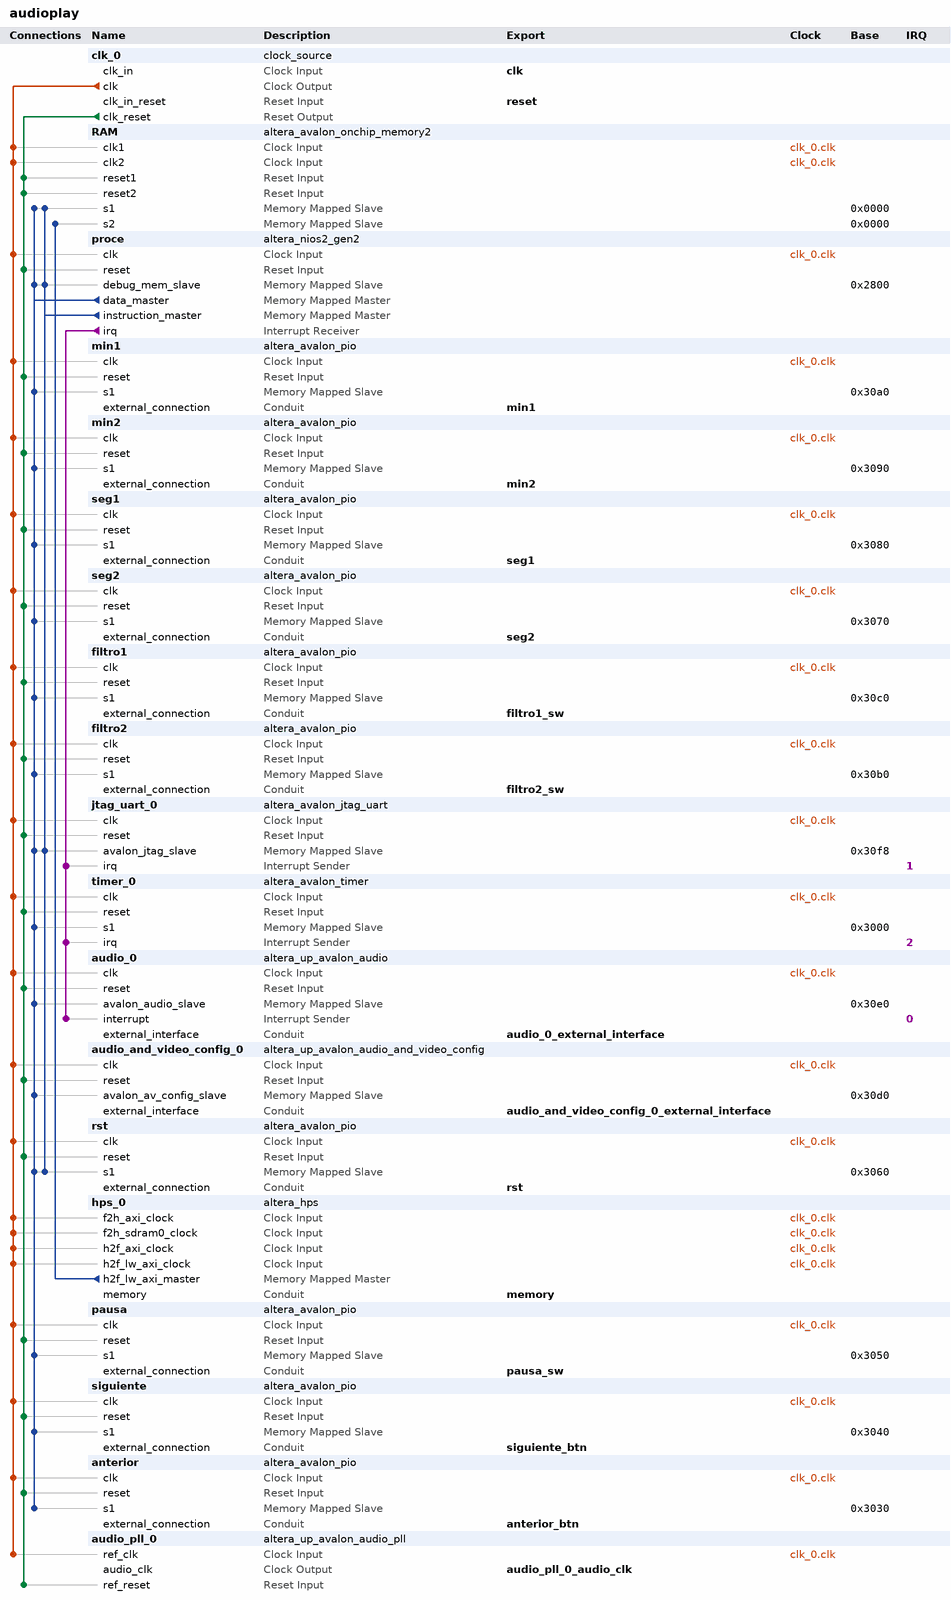
[diagram p0: system contents]
# Platform Designer (Qsys) system audioplay, Cyclone V 5CSEMA5F31C6
# Parameters at their usual value, and those the tool derives, are not listed.
package require -exact qsys 18.0
create_system audioplay
set_project_property DEVICE_FAMILY {Cyclone V}
set_project_property DEVICE 5CSEMA5F31C6

add_instance clk_0 clock_source 18.0
set_instance_parameter_value clk_0 clockFrequency 50000000

add_instance RAM altera_avalon_onchip_memory2 18.0
set_instance_parameter_value RAM dataWidth 32
set_instance_parameter_value RAM dualPort true
set_instance_parameter_value RAM initMemContent true
set_instance_parameter_value RAM initializationFileName onchip_mem.hex
set_instance_parameter_value RAM memorySize 8192

add_instance proce altera_nios2_gen2 18.0
set_instance_parameter_value proce dcache_size 2048
set_instance_parameter_value proce exceptionSlave RAM.s1
set_instance_parameter_value proce icache_size 4096
set_instance_parameter_value proce impl Fast
set_instance_parameter_value proce resetSlave RAM.s1

add_instance min1 altera_avalon_pio 18.0
set_instance_parameter_value min1 direction Output
set_instance_parameter_value min1 width 7

add_instance min2 altera_avalon_pio 18.0
set_instance_parameter_value min2 direction Output
set_instance_parameter_value min2 width 7

add_instance seg1 altera_avalon_pio 18.0
set_instance_parameter_value seg1 direction Output
set_instance_parameter_value seg1 width 7

add_instance seg2 altera_avalon_pio 18.0
set_instance_parameter_value seg2 direction Output
set_instance_parameter_value seg2 width 7

add_instance filtro1 altera_avalon_pio 18.0
set_instance_parameter_value filtro1 direction Input
set_instance_parameter_value filtro1 width 1

add_instance filtro2 altera_avalon_pio 18.0
set_instance_parameter_value filtro2 direction Input
set_instance_parameter_value filtro2 width 1

add_instance jtag_uart_0 altera_avalon_jtag_uart 18.0
set_instance_parameter_value jtag_uart_0 simInteractiveOptions NO_INTERACTIVE_WINDOWS

add_instance timer_0 altera_avalon_timer 18.0
set_instance_parameter_value timer_0 period 1
set_instance_parameter_value timer_0 periodUnits MSEC

add_instance audio_0 altera_up_avalon_audio 18.0
set_instance_parameter_value audio_0 audio_in false
set_instance_parameter_value audio_0 avalon_bus_type {Memory Mapped}
set_instance_parameter_value audio_0 dw 24

add_instance audio_and_video_config_0 altera_up_avalon_audio_and_video_config 18.0
set_instance_parameter_value audio_and_video_config_0 audio_in {Microphone to ADC}
set_instance_parameter_value audio_and_video_config_0 bit_length 24
set_instance_parameter_value audio_and_video_config_0 board DE1-SoC
set_instance_parameter_value audio_and_video_config_0 line_in_bypass false
set_instance_parameter_value audio_and_video_config_0 sampling_rate {48 kHz}

add_instance rst altera_avalon_pio 18.0
set_instance_parameter_value rst direction Input
set_instance_parameter_value rst width 1

add_instance hps_0 altera_hps 18.0
set_instance_parameter_value hps_0 EMAC1_Mode N/A
set_instance_parameter_value hps_0 EMAC1_PinMuxing Unused
set_instance_parameter_value hps_0 F2SCLK_COLDRST_Enable false
set_instance_parameter_value hps_0 F2SCLK_DBGRST_Enable false
set_instance_parameter_value hps_0 F2SCLK_WARMRST_Enable false
set_instance_parameter_value hps_0 F2SDRAM_Type AXI-3
set_instance_parameter_value hps_0 F2SDRAM_Width 64
set_instance_parameter_value hps_0 F2SINTERRUPT_Enable false
set_instance_parameter_value hps_0 F2S_Width 2
set_instance_parameter_value hps_0 FPGA_PERIPHERAL_OUTPUT_CLOCK_FREQ_EMAC0_GTX_CLK 125
set_instance_parameter_value hps_0 FPGA_PERIPHERAL_OUTPUT_CLOCK_FREQ_EMAC0_MD_CLK 2.5
set_instance_parameter_value hps_0 FPGA_PERIPHERAL_OUTPUT_CLOCK_FREQ_EMAC1_GTX_CLK 125
set_instance_parameter_value hps_0 FPGA_PERIPHERAL_OUTPUT_CLOCK_FREQ_EMAC1_MD_CLK 2.5
set_instance_parameter_value hps_0 HPS_PROTOCOL DDR3
set_instance_parameter_value hps_0 I2C0_Mode N/A
set_instance_parameter_value hps_0 I2C0_PinMuxing Unused
set_instance_parameter_value hps_0 I2C1_Mode N/A
set_instance_parameter_value hps_0 I2C1_PinMuxing Unused
set_instance_parameter_value hps_0 LWH2F_Enable true
set_instance_parameter_value hps_0 MEM_BANKADDR_WIDTH 3
set_instance_parameter_value hps_0 MEM_CLK_FREQ 300.0
set_instance_parameter_value hps_0 MEM_CLK_FREQ_MAX 400.0
set_instance_parameter_value hps_0 MEM_COL_ADDR_WIDTH 8
set_instance_parameter_value hps_0 MEM_DQ_WIDTH 8
set_instance_parameter_value hps_0 MEM_DRV_STR RZQ/6
set_instance_parameter_value hps_0 MEM_ROW_ADDR_WIDTH 12
set_instance_parameter_value hps_0 MEM_RTT_NOM {ODT Disabled}
set_instance_parameter_value hps_0 MEM_RTT_WR {Dynamic ODT off}
set_instance_parameter_value hps_0 MEM_TCL 7
set_instance_parameter_value hps_0 MEM_TFAW_NS 37.5
set_instance_parameter_value hps_0 MEM_TINIT_US 499
set_instance_parameter_value hps_0 MEM_TMRD_CK 3
set_instance_parameter_value hps_0 MEM_TRAS_NS 40.0
set_instance_parameter_value hps_0 MEM_TRCD_NS 15.0
set_instance_parameter_value hps_0 MEM_TREFI_US 7.0
set_instance_parameter_value hps_0 MEM_TRFC_NS 75.0
set_instance_parameter_value hps_0 MEM_TRP_NS 15.0
set_instance_parameter_value hps_0 MEM_TWTR 2
set_instance_parameter_value hps_0 MEM_VENDOR JEDEC
set_instance_parameter_value hps_0 MEM_WTCL 6
set_instance_parameter_value hps_0 MPU_EVENTS_Enable true
set_instance_parameter_value hps_0 QSPI_Mode N/A
set_instance_parameter_value hps_0 QSPI_PinMuxing Unused
set_instance_parameter_value hps_0 REF_CLK_FREQ 125.0
set_instance_parameter_value hps_0 S2FCLK_USER2CLK 5
set_instance_parameter_value hps_0 S2F_Width 2
set_instance_parameter_value hps_0 SDIO_Mode N/A
set_instance_parameter_value hps_0 SDIO_PinMuxing Unused
set_instance_parameter_value hps_0 SPIM1_Mode N/A
set_instance_parameter_value hps_0 SPIM1_PinMuxing Unused
set_instance_parameter_value hps_0 STM_Enable false
set_instance_parameter_value hps_0 TIMING_BOARD_AC_SKEW 0.02
set_instance_parameter_value hps_0 TIMING_BOARD_AC_TO_CK_SKEW 0.0
set_instance_parameter_value hps_0 TIMING_BOARD_DQ_TO_DQS_SKEW 0.0
set_instance_parameter_value hps_0 TIMING_BOARD_MAX_CK_DELAY 0.6
set_instance_parameter_value hps_0 TIMING_BOARD_MAX_DQS_DELAY 0.6
set_instance_parameter_value hps_0 TIMING_BOARD_SKEW_BETWEEN_DQS 0.02
set_instance_parameter_value hps_0 TIMING_BOARD_SKEW_CKDQS_DIMM_MAX 0.01
set_instance_parameter_value hps_0 TIMING_BOARD_SKEW_CKDQS_DIMM_MIN -0.01
set_instance_parameter_value hps_0 TIMING_BOARD_SKEW_WITHIN_DQS 0.02
set_instance_parameter_value hps_0 TIMING_TDH 125
set_instance_parameter_value hps_0 TIMING_TDQSCK 400
set_instance_parameter_value hps_0 TIMING_TDQSQ 120
set_instance_parameter_value hps_0 TIMING_TDS 50
set_instance_parameter_value hps_0 TIMING_TIH 250
set_instance_parameter_value hps_0 TIMING_TIS 175
set_instance_parameter_value hps_0 TIMING_TQSH 0.38
set_instance_parameter_value hps_0 UART0_Mode N/A
set_instance_parameter_value hps_0 UART0_PinMuxing Unused
set_instance_parameter_value hps_0 USB1_Mode N/A
set_instance_parameter_value hps_0 USB1_PinMuxing Unused
set_instance_parameter_value hps_0 desired_cfg_clk_mhz 100.0
set_instance_parameter_value hps_0 desired_qspi_clk_mhz 400.0

add_instance pausa altera_avalon_pio 18.0
set_instance_parameter_value pausa direction Input
set_instance_parameter_value pausa width 1

add_instance siguiente altera_avalon_pio 18.0
set_instance_parameter_value siguiente direction Input
set_instance_parameter_value siguiente width 1

add_instance anterior altera_avalon_pio 18.0
set_instance_parameter_value anterior direction Input
set_instance_parameter_value anterior width 1

add_instance audio_pll_0 altera_up_avalon_audio_pll 18.0
set_instance_parameter_value audio_pll_0 gui_refclk 50.0

# connections
add_connection clk_0.clk anterior.clk clock
add_connection clk_0.clk audio_0.clk clock
add_connection clk_0.clk audio_and_video_config_0.clk clock
add_connection clk_0.clk audio_pll_0.ref_clk clock
add_connection clk_0.clk filtro1.clk clock
add_connection clk_0.clk filtro2.clk clock
add_connection clk_0.clk hps_0.f2h_axi_clock clock
add_connection clk_0.clk hps_0.f2h_sdram0_clock clock
add_connection clk_0.clk hps_0.h2f_axi_clock clock
add_connection clk_0.clk hps_0.h2f_lw_axi_clock clock
add_connection clk_0.clk jtag_uart_0.clk clock
add_connection clk_0.clk min1.clk clock
add_connection clk_0.clk min2.clk clock
add_connection clk_0.clk pausa.clk clock
add_connection clk_0.clk proce.clk clock
add_connection clk_0.clk RAM.clk1 clock
add_connection clk_0.clk RAM.clk2 clock
add_connection clk_0.clk rst.clk clock
add_connection clk_0.clk seg1.clk clock
add_connection clk_0.clk seg2.clk clock
add_connection clk_0.clk siguiente.clk clock
add_connection clk_0.clk timer_0.clk clock
add_connection clk_0.clk_reset anterior.reset reset
add_connection clk_0.clk_reset audio_0.reset reset
add_connection clk_0.clk_reset audio_and_video_config_0.reset reset
add_connection clk_0.clk_reset audio_pll_0.ref_reset reset
add_connection clk_0.clk_reset filtro1.reset reset
add_connection clk_0.clk_reset filtro2.reset reset
add_connection clk_0.clk_reset jtag_uart_0.reset reset
add_connection clk_0.clk_reset min1.reset reset
add_connection clk_0.clk_reset min2.reset reset
add_connection clk_0.clk_reset pausa.reset reset
add_connection clk_0.clk_reset proce.reset reset
add_connection clk_0.clk_reset RAM.reset1 reset
add_connection clk_0.clk_reset RAM.reset2 reset
add_connection clk_0.clk_reset rst.reset reset
add_connection clk_0.clk_reset seg1.reset reset
add_connection clk_0.clk_reset seg2.reset reset
add_connection clk_0.clk_reset siguiente.reset reset
add_connection clk_0.clk_reset timer_0.reset reset
add_connection hps_0.h2f_lw_axi_master RAM.s2 avalon
set_connection_parameter_value hps_0.h2f_lw_axi_master/RAM.s2 baseAddress 0x0000
add_connection proce.data_master anterior.s1 avalon
set_connection_parameter_value proce.data_master/anterior.s1 baseAddress 0x3030
add_connection proce.data_master audio_0.avalon_audio_slave avalon
set_connection_parameter_value proce.data_master/audio_0.avalon_audio_slave baseAddress 0x30e0
add_connection proce.data_master audio_and_video_config_0.avalon_av_config_slave avalon
set_connection_parameter_value proce.data_master/audio_and_video_config_0.avalon_av_config_slave baseAddress 0x30d0
add_connection proce.data_master filtro1.s1 avalon
set_connection_parameter_value proce.data_master/filtro1.s1 baseAddress 0x30c0
add_connection proce.data_master filtro2.s1 avalon
set_connection_parameter_value proce.data_master/filtro2.s1 baseAddress 0x30b0
add_connection proce.data_master jtag_uart_0.avalon_jtag_slave avalon
set_connection_parameter_value proce.data_master/jtag_uart_0.avalon_jtag_slave baseAddress 0x30f8
add_connection proce.data_master min1.s1 avalon
set_connection_parameter_value proce.data_master/min1.s1 baseAddress 0x30a0
add_connection proce.data_master min2.s1 avalon
set_connection_parameter_value proce.data_master/min2.s1 baseAddress 0x3090
add_connection proce.data_master pausa.s1 avalon
set_connection_parameter_value proce.data_master/pausa.s1 baseAddress 0x3050
add_connection proce.data_master proce.debug_mem_slave avalon
set_connection_parameter_value proce.data_master/proce.debug_mem_slave baseAddress 0x2800
add_connection proce.data_master RAM.s1 avalon
set_connection_parameter_value proce.data_master/RAM.s1 baseAddress 0x0000
add_connection proce.data_master rst.s1 avalon
set_connection_parameter_value proce.data_master/rst.s1 baseAddress 0x3060
add_connection proce.data_master seg1.s1 avalon
set_connection_parameter_value proce.data_master/seg1.s1 baseAddress 0x3080
add_connection proce.data_master seg2.s1 avalon
set_connection_parameter_value proce.data_master/seg2.s1 baseAddress 0x3070
add_connection proce.data_master siguiente.s1 avalon
set_connection_parameter_value proce.data_master/siguiente.s1 baseAddress 0x3040
add_connection proce.data_master timer_0.s1 avalon
set_connection_parameter_value proce.data_master/timer_0.s1 baseAddress 0x3000
add_connection proce.instruction_master jtag_uart_0.avalon_jtag_slave avalon
set_connection_parameter_value proce.instruction_master/jtag_uart_0.avalon_jtag_slave baseAddress 0x30f8
add_connection proce.instruction_master proce.debug_mem_slave avalon
set_connection_parameter_value proce.instruction_master/proce.debug_mem_slave baseAddress 0x2800
add_connection proce.instruction_master RAM.s1 avalon
set_connection_parameter_value proce.instruction_master/RAM.s1 baseAddress 0x0000
add_connection proce.instruction_master rst.s1 avalon
set_connection_parameter_value proce.instruction_master/rst.s1 baseAddress 0x3060
add_connection proce.irq audio_0.interrupt interrupt
set_connection_parameter_value proce.irq/audio_0.interrupt irqNumber 0
add_connection proce.irq jtag_uart_0.irq interrupt
set_connection_parameter_value proce.irq/jtag_uart_0.irq irqNumber 1
add_connection proce.irq timer_0.irq interrupt
set_connection_parameter_value proce.irq/timer_0.irq irqNumber 2

# exported interfaces
add_interface anterior_btn conduit end
set_interface_property anterior_btn EXPORT_OF anterior.external_connection
add_interface audio_0_external_interface conduit end
set_interface_property audio_0_external_interface EXPORT_OF audio_0.external_interface
add_interface audio_and_video_config_0_external_interface conduit end
set_interface_property audio_and_video_config_0_external_interface EXPORT_OF audio_and_video_config_0.external_interface
add_interface audio_pll_0_audio_clk clock source
set_interface_property audio_pll_0_audio_clk EXPORT_OF audio_pll_0.audio_clk
add_interface clk clock sink
set_interface_property clk EXPORT_OF clk_0.clk_in
add_interface filtro1_sw conduit end
set_interface_property filtro1_sw EXPORT_OF filtro1.external_connection
add_interface filtro2_sw conduit end
set_interface_property filtro2_sw EXPORT_OF filtro2.external_connection
add_interface memory conduit end
set_interface_property memory EXPORT_OF hps_0.memory
add_interface min1 conduit end
set_interface_property min1 EXPORT_OF min1.external_connection
add_interface min2 conduit end
set_interface_property min2 EXPORT_OF min2.external_connection
add_interface pausa_sw conduit end
set_interface_property pausa_sw EXPORT_OF pausa.external_connection
add_interface reset reset sink
set_interface_property reset EXPORT_OF clk_0.clk_in_reset
add_interface rst conduit end
set_interface_property rst EXPORT_OF rst.external_connection
add_interface seg1 conduit end
set_interface_property seg1 EXPORT_OF seg1.external_connection
add_interface seg2 conduit end
set_interface_property seg2 EXPORT_OF seg2.external_connection
add_interface siguiente_btn conduit end
set_interface_property siguiente_btn EXPORT_OF siguiente.external_connection

set_interconnect_requirement {$system} qsys_mm.clockCrossingAdapter HANDSHAKE
set_interconnect_requirement {$system} qsys_mm.enableEccProtection FALSE
set_interconnect_requirement {$system} qsys_mm.insertDefaultSlave FALSE
set_interconnect_requirement {$system} qsys_mm.maxAdditionalLatency 1

save_system audioplay.qsys
